# Altium project Ilk Proje.PrjPcb (part 1 of 3)
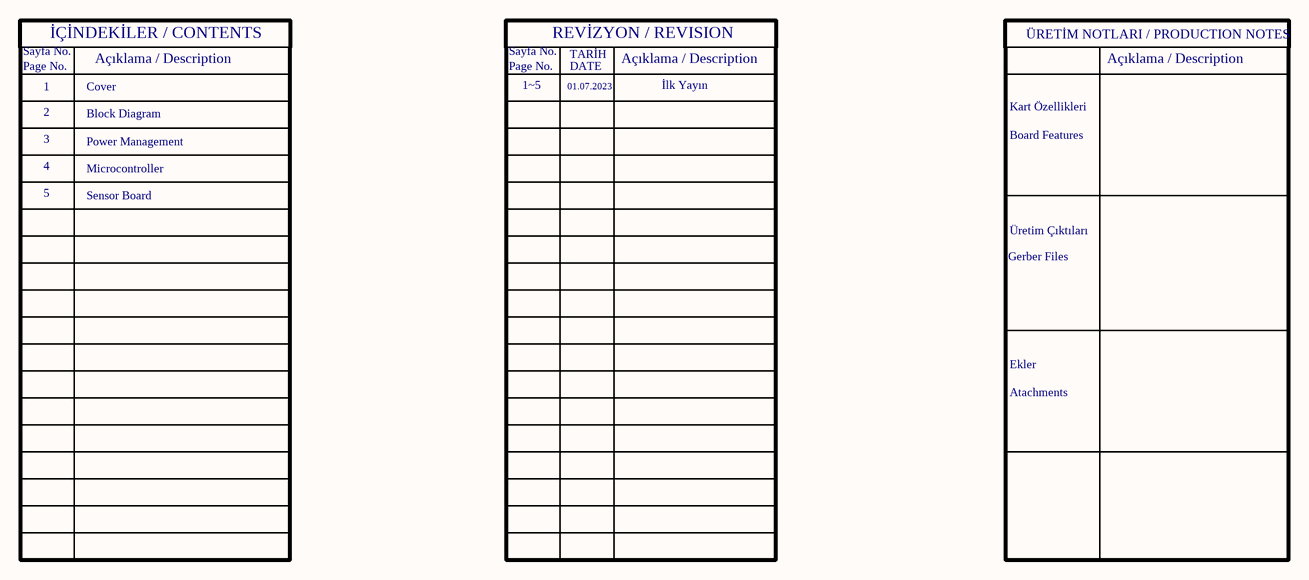
[diagram p0: Cover.SchDoc]
5 sheets, 127 parts. Net scope: global (net labels, ports and power ports of the same name join across sheets).
Board file: ilkproje.PcbDoc
Sheets:
  Cover.SchDoc
  Block Diyagrami.SchDoc
  Power Management.SchDoc
  MicroController.SchDoc
  Sensor Board.SchDoc

## Sheet Cover.SchDoc: Wireless Security Detector
size A4; SheetNumber: 1; SheetTotal: 5

### Notes on the sheet
- Sayfa No.
- Page No.
- İÇİNDEKİLER / CONTENTS
- Açıklama / Description
- REVİZYON / REVISION
- TARİH
- DATE
- ÜRETİM NOTLARI / PRODUCTION NOTES
- 1
- 2
- 3
- Cover
- Block Diagram
- 1~5
- 01.07.2023
- İlk Yayın
- Kart Özellikleri
- Board Features
- 4
- 5
- Power Management
- Microcontroller
- Sensor Board
- Gerber Files
- Üretim Çıktıları
- Ekler
- Atachments

## Sheet Block Diyagrami.SchDoc: Wireless Security Detector
size A3; ApprovedBy: Berke Tırpan; SheetNumber: 2; SheetTotal: 2; ENG_APP_DATE: --/--/--; DSN_APP_DATE: --/--/--; CHK_APP_DATE: --/--/--
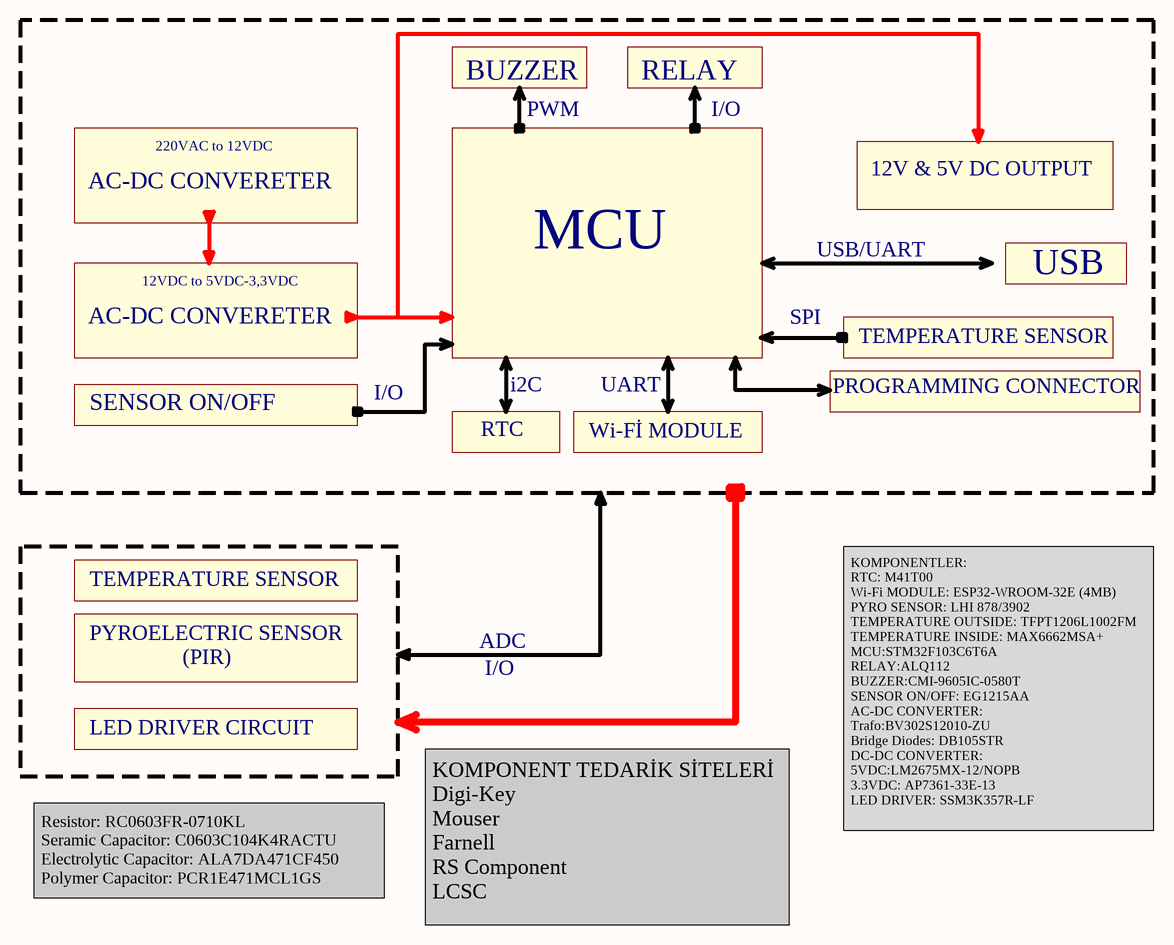
[diagram p1: Block Diyagrami.SchDoc]

### Notes on the sheet
- BUZZER
- RELAY
- 220VAC to 12VDC
- PWM
- I/O
- AC-DC CONVERETER
- 12V & 5V DC OUTPUT
- 12VDC to 5VDC-3,3VDC
- MCU
- USB/UART
- USB
- SPI
- TEMPERATURE SENSOR
- SENSOR ON/OFF
- RTC
- i2C
- Wi-Fİ MODULE
- UART
- PROGRAMMING CONNECTOR
- PYROELECTRIC SENSOR
- (PIR)
- ADC
- LED DRIVER CIRCUIT
- KOMPONENTLER:
  RTC: M41T00
  Wi-Fi MODULE: ESP32-WROOM-32E (4MB)
  PYRO SENSOR: LHI 878/3902
  TEMPERATURE OUTSIDE: TFPT1206L1002FM
  TEMPERATURE INSIDE: MAX6662MSA+
  MCU:STM32F103C6T6A
  RELAY:ALQ112
  BUZZER:CMI-9605IC-0580T
  SENSOR ON/OFF: EG1215AA
  AC-DC CONVERTER:
  Trafo:BV302S12010-ZU
  Bridge Diodes: DB105STR
  DC-DC CONVERTER:
  5VDC:LM2675MX-12/NOPB
  3.3VDC: AP7361-33E-13
  LED DRIVER: SSM3K357R-LF
- Resistor: RC0603FR-0710KL
  Seramic Capacitor: C0603C104K4RACTU
  Electrolytic Capacitor: ALA7DA471CF450
  Polymer Capacitor: PCR1E471MCL1GS
- KOMPONENT TEDARİK SİTELERİ
  Digi-Key
  Mouser
  Farnell
  RS Component
  LCSC

## Sheet Power Management.SchDoc: Wireless Security
size A3; Date: 29.06.2023; CompanyName: Freelance; Engineer: Berke Tırpan; SheetNumber: 3; SheetTotal: 5; PageSize: A3
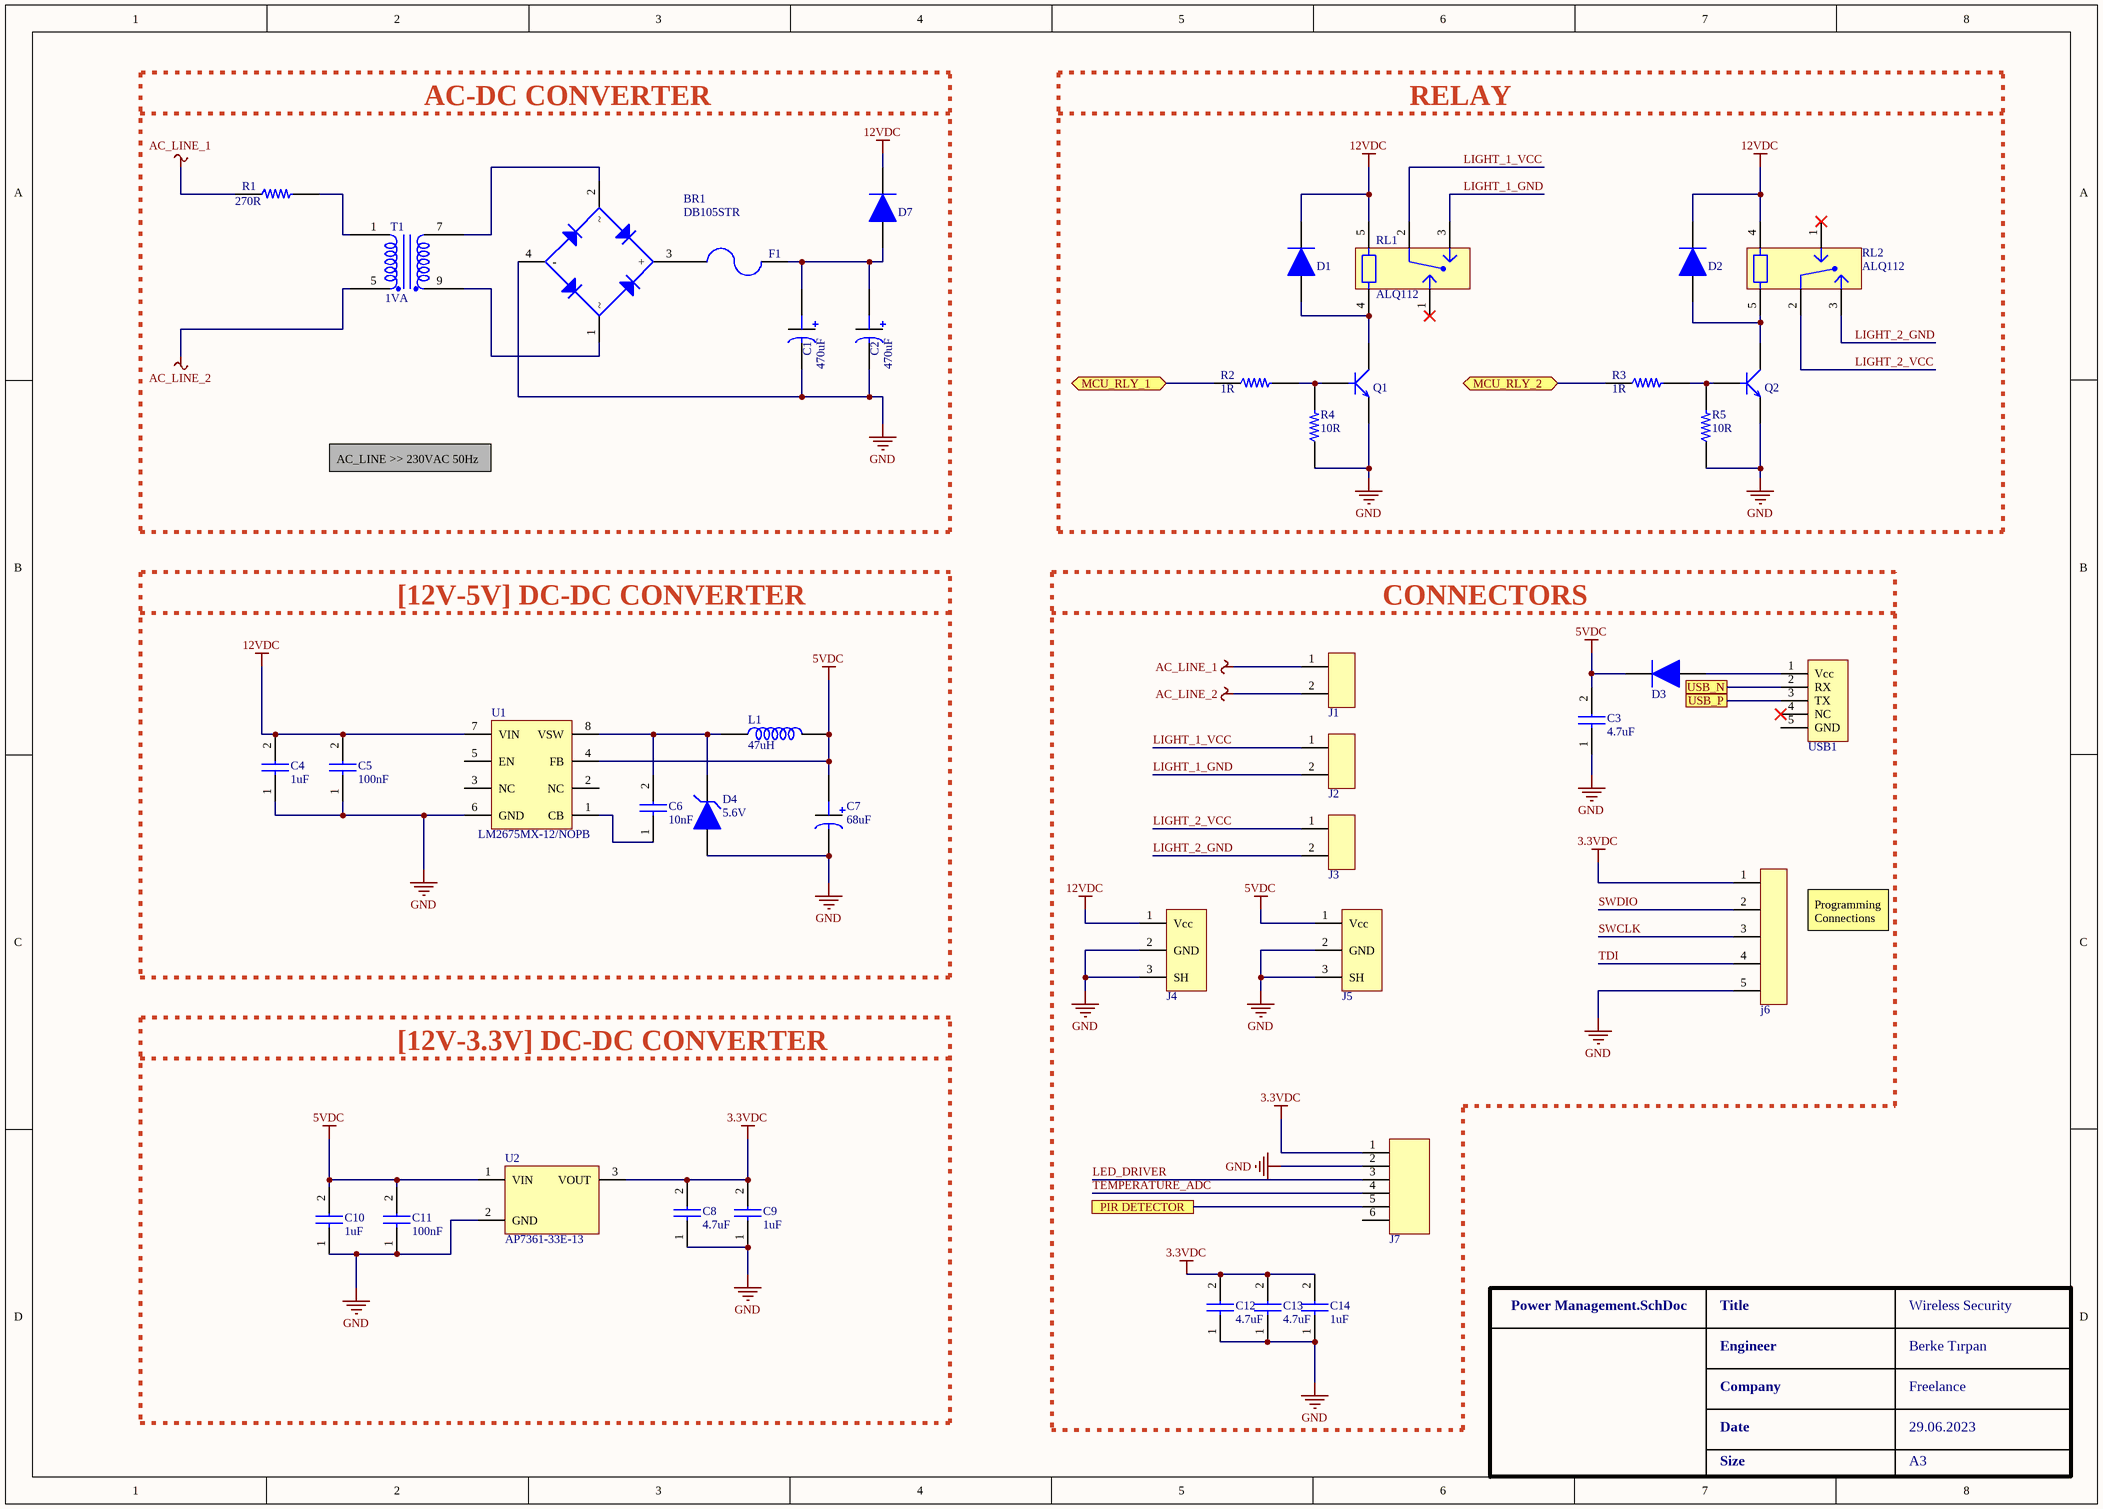
[diagram p2: Power Management.SchDoc]

### Parts
BR1  DB105STR  [DB105STR]
C1  Capacitance: 470uF  [CAP_RADIAL_D10_P5]  (hidden comment: ESH477M050AH4AA)
C2  Capacitance: 470uF  [CAP_RADIAL_D10_P5]  (hidden comment: ESH477M050AH4AA)
C3  Capacitance: 4.7uF  [CAP_0805]  (hidden comment: CAP_CER_4,7UF_0805)
C4  Capacitance: 1uF  [CAP_0805]  (hidden comment: CAP CER 1uF 0805)
C5  Capacitance: 100nF  [CAP_0805]  (hidden comment: CAP CER 100nF 0805)
C6  Capacitance: 10nF  [CAP_0603]  (hidden comment: CAP CER 10nF 0603)
C7  Capacitance: 68uF  [CAP_EEVSERIES]  (hidden comment: EEV686M035A9HAA)
C8  Capacitance: 4.7uF  [CAP_0805]  (hidden comment: CAP_CER_4,7UF_0805)
C9  Capacitance: 1uF  [CAP_0805]  (hidden comment: CAP CER 1uF 0805)
C10  Capacitance: 1uF  [CAP_0805]  (hidden comment: CAP CER 1uF 0805)
C11  Capacitance: 100nF  [CAP_0603]  (hidden comment: C0603C104K5RACTU)
C12  Capacitance: 4.7uF  [CAP_0805]  (hidden comment: CAP_CER_4,7UF_0805)
C13  Capacitance: 4.7uF  [CAP_0805]  (hidden comment: CAP_CER_4,7UF_0805)
C14  Capacitance: 1uF  [CAP_0805]  (hidden comment: CAP CER 1uF 0805)
D1  1N4148WS  [SOD323F]  (value not drawn)
D2  1N4148WS  [SOD323F]  (value not drawn)
D3  1N4148WS  [SOD323F]  (value not drawn)
D4  Zener Voltage: 5.6V  [SMB]  (hidden comment: 1SMB5919BT3G)
D7  1N4148WS  [SOD323F]  (value not drawn)
F1  FUSE 3413.0216.22  [3413.0216.22]  (value not drawn)
J1  TBP01R1-508-02BE  [TBP01R1-508]  (value not drawn)
J2  TBP01R1-508-02BE  [TBP01R1-508]  (value not drawn)
J3  TBP01R1-508-02BE  [TBP01R1-508]  (value not drawn)
J4  PJ-037AH-SMT-TR  [JACK]  (value not drawn)
J5  PJ-037AH-SMT-TR  [JACK]  (value not drawn)
j6  SMH-105-02-L-S  [PINHEADER1X5_RA]  (value not drawn)
J7  64800611622  [64800611622]  (value not drawn)
L1  Inductance: 47uH  [IND_1212]  (hidden comment: 78438335470)
Q1  MMBT3904-7-F  [SOT23-F]  (value not drawn)
Q2  MMBT3904-7-F  [SOT23-F]  (value not drawn)
R1  Resistance: 270R  [RES_AXIAL_W]  (hidden comment: 5WD27)
R2  Resistance: 1R  [RES_0603]  (hidden comment: RT0603BRD071KL)
R3  Resistance: 1R  [RES_0603]  (hidden comment: RT0603BRD071KL)
R4  Resistance: 10R  [RES_0603]  (hidden comment: RC0603FR-0710KL)
R5  Resistance: 10R  [RES_0603]  (hidden comment: RC0603FR-0710KL)
RL1  ALQ112  [ALQ112]
RL2  ALQ112  [ALQ112]
T1  Rated Power: 1VA  [BV302S12010-ZU]  (hidden comment: BV302S12010-ZU)
U1  LM2675MX-12/NOPB  [SOIC8]
U2  AP7361-33E-13  [SOT223]
USB1  10118192-0001LF  [MICRO_B_USB]  (value not drawn)

### Blocks framed on the sheet
AC-DC CONVERTER: BR1 C1 C2 D7 F1 R1 T1
RELAY: D1 D2 Q1 Q2 R2-R5 RL1 RL2
[12V-5V] DC-DC CONVERTER: C4-C7 D4 L1 U1
CONNECTORS: C3 C12-C14 D3 J1-J5 j6 J7 USB1
[12V-3.3V] DC-DC CONVERTER: C8-C11 U2

### Ports
MCU_RLY_1 (bidir, see MicroController[4B]), MCU_RLY_2 (bidir, see MicroController[4B]), PIR DETECTOR (see MicroController[4B]), USB_N (see MicroController[4A]), USB_P (see MicroController[4A])

### Nets
3.3VDC: C8.2 C9.2 C12.2 C13.2 C14.2 j6.1 J7.1 U2.3(VOUT)
5VDC: C3.2 C7.1 C10.2 C11.2 D3.1 J5.1(Vcc) L1.2 U1.4(FB) U2.1(VIN)
12VDC: C4.2 C5.2 D1.1 D2.1 D7.1 J4.1(Vcc) RL1.5 RL2.4 U1.7(VIN)
AC_LINE_1: J1.1 R1.1
AC_LINE_2: J1.2 T1.5
GND: BR1.4(-) C1.2 C2.2 C3.1 C4.1 C5.1 C7.2 C8.1 C9.1 C10.1 C11.1 C12.1 C13.1 C14.1 D4.A J4.2(GND) J4.3(SH) J5.2(GND) J5.3(SH) j6.5 J7.2 Q1.2(E) Q2.2(E) R4.1 R5.1 U1.6(GND) U2.2(GND)
LED_DRIVER: J7.3
LIGHT_1_GND: J2.2 RL1.3
LIGHT_1_VCC: J2.1 RL1.2
LIGHT_2_GND: J3.2 RL2.3
LIGHT_2_VCC: J3.1 RL2.2
SWCLK: j6.3
SWDIO: j6.2
TDI: j6.4
TEMPERATURE_ADC: J7.4
USB_N: USB1.2(RX) ; port USB_N
USB_P: USB1.3(TX) ; port USB_P
NetBR1_1: BR1.1 T1.9
NetBR1_2: BR1.2 T1.7
NetBR1_3: BR1.3(+) F1.1
NetC1_1: C1.1 C2.1 D7.2 F1.2
NetC6_1: C6.1 U1.1(CB)
NetC6_2: C6.2 D4.C L1.1 U1.8(VSW)
NetD1_2: D1.2 Q1.3(C) RL1.4
NetD2_2: D2.2 Q2.3(C) RL2.5
NetD3_2: D3.2 USB1.1(Vcc)
NetJ7_5: J7.5 ; port PIR DETECTOR
NetQ1_1: Q1.1(B) R2.2 R4.2
NetQ2_1: Q2.1(B) R3.2 R5.2
NetR1_2: R1.2 T1.1
NetR2_1: R2.1 ; port MCU_RLY_1
NetR3_1: R3.1 ; port MCU_RLY_2

Not connected (* = marked no-connect by the designer): J7 6; RL1 1*; RL2 1*; U1 2(NC) 3(NC) 5(EN); USB1 4(NC)* 5(GND)

### Notes on the sheet
- AC_LINE >> 230VAC 50Hz
- (near j6) Programming Connections
- Title
- Engineer
- Company
- Date
- Size

### Library data of the parts
BR1 = DB105STR: Bridge Rect 1PHASE 600V 1A Db-s; Manufacturer: Sangdest Microelectronics; Manufacturer Part Number: DB105S; Desinged by: BERKE; Supplier 1: Digi-Key; RoHS: No; Category: Uncategorized; Stock 1: 22736; Pricing 1: 1=0,42, 10=0,314, 100=0,1957, 500=0,1339 (USD); Supplier Part Number 1: 1655-DB105SCT-ND; Operating Voltage: 600V; Max Current: 1A
C1 C2 = CAP ALU ELEC 470.UF 50V: Cap, 470UF, 50V, Alu Elec, Radial; Manufacturer: KEMET; Desinged by: BERKE; Tolerance: 20%; Supplier 1: Digi-Key; Manufacturer Part Number: ESH477M050AH4AA; RoHS: Yes; Stock 1: 6765; Pricing 1: 1=0,7, 10=0,496, 50=0,3748, 100=0,3264, 500=0,24178, 1000=0,20551, 2500=0,19342, 5000=0,18134 (USD); Mount: Through Hole; Case/Package: Radial; Min Operating Temperature: -40°C; Max Operating Temperature: 105°C; Packaging: Bulk; Voltage Rating: 50V; Series: ESH; RoHS Compliant: Yes; ComponentLink1URL: https://api.kemet.com/component-edge/download/datasheet/ESH477M050AH4AA.pdf?src-supplier=Digi-Key; ComponentLink1Description: https://api.kemet.com/component-edge/download/datasheet/ESH477M050AH4AA.pdf?src-supplier=Digi-Key; Supplier Part Number 1: 399-15683-ND
C3 C8 C12 C13 = CAP_CER_4,7UF_0805: CAP CER 4.7UF 25V %10 0805; Manufacturer: Samsung; Manufacturer Part Number: CL21A475KAQNNNE; Tolerance: 10%; Dielectric: X5R; Desinged by: BERKE; Supplier 1: Digi-Key; RoHS: Yes; Category: Ceramic Capacitors; Stock 1: 4065249; Pricing 1: 1=0,1, 10=0,073, 50=0,0414, 100=0,0344, 500=0,02408, 1000=0,01994 (USD); Mount: Surface Mount; Case/Package: 0805; Case Code (Metric): 2012; Case Code (Imperial): 0805; Min Operating Temperature: -55°C; Max Operating Temperature: 85°C; Packaging: Tape and Reel; Voltage Rating: 25V; Voltage Rating (DC): 25V; Series: CL; Construction: Flat; Length: 2mm; Height: 1.25mm; Depth: 1.25mm; Radiation Hardening: No; Lead Free: Lead Free; RoHS Compliant: Yes; ComponentLink1URL: https://datasheet.ciiva.com/25798/cl21a475kaqnnne-25798882.pdf?src-supplier=Digi-Key; ComponentLink1Description: https://datasheet.ciiva.com/25798/cl21a475kaqnnne-25798882.pdf?src-supplier=Digi-Key; Supplier Part Number 1: 1276-1244-1-ND
C4 C9 C10 C14 = CAP CER 1uF 0805: CAP CER 1UF 50V X7R %10 0805; Manufacturer: Samsung; Manufacturer Part Number: CL21B105KBFNNNE; Desinged by: BERKE; Tolerance: 10%; Supplier 1: Digi-Key; RoHS: Yes; Category: Ceramic Capacitors; Stock 1: 84626; Pricing 1: 1=0,11, 10=0,079, 50=0,045, 100=0,0373, 500=0,02616, 1000=0,02165 (USD); Mount: Surface Mount; Case/Package: 0805; Case Code (Metric): 2012; Case Code (Imperial): 0805; Min Operating Temperature: -55°C; Max Operating Temperature: 125°C; Packaging: Tape and Reel; Package Quantity: 1; Voltage Rating: 50V; Dielectric: X7R; Voltage: 50V; Series: CL; Construction: Flat; Length: 2mm; Width: 0.049inch; Height: 1.25mm; Thickness: 0.053inch; Depth: 1.25mm; Radiation Hardening: No; RoHS Compliant: Yes; ComponentLink1URL: https://datasheet.ciiva.com/25800/cl21b105kbfnnne-25800291.pdf?src-supplier=Digi-Key; ComponentLink1Description: https://datasheet.ciiva.com/25800/cl21b105kbfnnne-25800291.pdf?src-supplier=Digi-Key; Supplier Part Number 1: 1276-1029-1-ND
C5 = CAP CER 100nF 0805: CAP CER 0.1UF 50V X7R 0805; Manufacturer: Samsung; Manufacturer Part Number: CL21B104KBCNNNC; Desinged by: BERKE; Material: Ceramic; Tolerance: 10%; Supplier 1: Digi-Key; RoHS: Yes; Category: Ceramic Capacitors; Stock 1: 1331466; Pricing 1: 1=0,1, 10=0,044, 50=0,024, 100=0,0196, 500=0,01404, 1000=0,01103 (USD); Mount: Surface Mount; Case/Package: 0805; Case Code (Metric): 2012; Case Code (Imperial): 0805; Min Operating Temperature: -55°C; Max Operating Temperature: 125°C; Dielectric: X7R; Packaging: Tape and Reel; Voltage Rating: 50V; Voltage: 50V; Voltage Rating (DC): 50V; Series: CL; Construction: Flat; Length: 2mm; Width: 0.049inch; Height: 0.85mm; Depth: 1.25mm; Thickness: 0.037inch; Radiation Hardening: No; Lead Free: Lead Free; RoHS Compliant: Yes; ComponentLink1URL: https://datasheet.ciiva.com/25710/cl21b104kbcnnnc-25710182.pdf?src-supplier=Digi-Key; ComponentLink1Description: https://datasheet.ciiva.com/25710/cl21b104kbcnnnc-25710182.pdf?src-supplier=Digi-Key; ComponentLink2URL: https://datasheet.ciiva.com/29199/454152-da-01-en-vs-kondensator-0805-29199814.pdf?src-supplier=Conrad; ComponentLink2Description: https://datasheet.ciiva.com/29199/454152-da-01-en-vs-kondensator-0805-29199814.pdf?src-supplier=Conrad; Supplier Part Number 1: 1276-1003-1-ND
C6 = CAP CER 10nF 0603: Multilayer Ceramic Capacitor, 0.01 F, 10%, X7R, 16 V, 0603 [1608 Metric] RoHS Compliant: Yes; Manufacturer: Walsin Technologies; Manufacturer Part Number: 0603B103K160CT; Desinged by: BERKE; Voltage Rating: 16V; Supplier 1: Digi-Key; RoHS: Yes; Category: Ceramic Capacitors; Stock 1: 54105; Pricing 1: 1=0,1, 10=0,033, 50=0,0182, 100=0,0148, 500=0,0106, 1000=0,00833 (USD); Case Code (Metric): 1608; Case Code (Imperial): 0603; Min Operating Temperature: -55°C; Max Operating Temperature: 125°C; Tolerance: 10%; Packaging: Tape and Reel; Dielectric: X7R; Voltage Rating (DC): 16V; RoHS Compliant: Yes; Reach SVHC Compliant: Unknown; ComponentLink1URL: http://www.farnell.com/datasheets/1958513.pdf?src-supplier=Farnell; ComponentLink1Description: http://www.farnell.com/datasheets/1958513.pdf?src-supplier=Farnell; ComponentLink2URL: http://www.farnell.com/datasheets/1958513.pdf?src-supplier=Element14; ComponentLink2Description: http://www.farnell.com/datasheets/1958513.pdf?src-supplier=Element14; ComponentLink3URL: http://www.passivecomponent.com/wp-content/uploads/2018/10/MLCC.pdf?src-supplier=Digi-Key; ComponentLink3Description: http://www.passivecomponent.com/wp-content/uploads/2018/10/MLCC.pdf?src-supplier=Digi-Key; Supplier Part Number 1: 1292-1384-1-ND
C7 = CAP ALU 68uF: Cap Aluminum Lytic 68uF 35V 20% (6.3 X 7.7mm) SMD 280mA 2000h 105C T/R; Manufacturer: KEMET; Desinged by: BERKE; Impedance: 340mR; Ripple Current: 196mA; Supplier 1: Digi-Key; Manufacturer Part Number: EEV686M035A9HAA; RoHS: Yes; Category: Aluminum Electrolytic Capacitors; Stock 1: 22971; Pricing 1: 1=0,64, 10=0,451, 50=0,3414, 100=0,2973, 500=0,22022 (USD); Mount: Surface Mount; Case/Package: Radial; Min Operating Temperature: -40°C; Max Operating Temperature: 105°C; Packaging: Tape and Reel; Package Quantity: 1; Voltage Rating: 35V; Tolerance: 20%; Voltage Rating (DC): 35V; Termination: SMD/SMT; Series: EEV; Length: 7.7mm; Height - Seated (Max): 0.315inch; RoHS Compliant: Yes; ComponentLink1URL: https://datasheet.ciiva.com/5365/kem-a4002-eev-535332-5365784.pdf?src-supplier=Mouser; ComponentLink1Description: https://datasheet.ciiva.com/5365/kem-a4002-eev-535332-5365784.pdf?src-supplier=Mouser; Supplier Part Number 1: 399-6722-1-ND
C11 = CAP CER 100nF 0603: Multilayer Ceramic Capacitors (MLCC) - SMD/SMT 50volts 0.1uF X7R 10%; Manufacturer: KEMET; Voltage: 50V; Desinged by: BERKE; Supplier 1: Digi-Key; Manufacturer Part Number: C0603C104K5RACTU; RoHS: Yes; Category: Ceramic Capacitors; Stock 1: 10147790; Pricing 1: 1=0,11, 10=0,078, 50=0,0424, 100=0,0346, 500=0,02474, 1000=0,01944 (USD); Mount: Surface Mount; Case/Package: 0603; Min Operating Temperature: -55°C; Max Operating Temperature: 125°C; Tolerance: 10%; Packaging: Tape and Reel; Dielectric: X7R; Series: SMD Comm X7R; Voltage Rating: 50V; Length: 0.063inch; Width: 0.031inch; Thickness: 0.034inch; RoHS Compliant: Yes; Supplier Part Number 1: 399-C0603C104K5RAC7867CT-ND
D1-D3 D7 = 1N4148WS: VR=75V IF=150mA Trr=4ns P=200mW; Manufacturer: ON Semiconductor / Fairchild; Desinged by: BERKE; Forward Current: 150mA; Max Repetitive Reverse Voltage (Vrrm): 75V; Reverse Recovery Time: 4ns; Max Reverse Current: 5uA; Max Forward Surge Current (Ifsm): 2A; Element Configuration: Single; Supplier 1: Digi-Key; Manufacturer Part Number: 1N4148WS; RoHS: Yes; Category: Rectifier Diodes; Stock 1: 1609214; Pricing 1: 1=0,19, 10=0,174, 100=0,0949, 500=0,05838, 1000=0,0398 (USD); Mount: Surface Mount; Number of Pins: 2; Weight: 0.0276g; Min Operating Temperature: -55°C; Max Operating Temperature: 150°C; Packaging: Tape and Reel; Average Rectified Current: 150mA; Max Reverse Voltage (DC): 75V; Series: -; Package Quantity: 1; Recovery Time: 4ns; Reverse Voltage: 75V; Length: 1.8mm; Width: 1.35mm; Height: 1mm; Radiation Hardening: No; RoHS Compliant: Yes; Reach SVHC Compliant: No; Lead Free: Lead Free; ComponentLink1URL: https://datasheet.ciiva.com/30479/0900766b810e1cd3-30479206.pdf?src-supplier=Rs; ComponentLink1Description: https://datasheet.ciiva.com/30479/0900766b810e1cd3-30479206.pdf?src-supplier=Rs; ComponentLink2URL: https://datasheet.ciiva.com/15208/getdatasheetpartid-127819-15208358.pdf?src-supplier=Verical; ComponentLink2Description: https://datasheet.ciiva.com/15208/getdatasheetpartid-127819-15208358.pdf?src-supplier=Verical; ComponentLink3URL: https://datasheet.ciiva.com/8300/1n914bws-8300360.pdf?src-supplier=Avnet; ComponentLink3Description: https://datasheet.ciiva.com/8300/1n914bws-8300360.pdf?src-supplier=Avnet; ComponentLink4URL: https://datasheet.ciiva.com/910/1n4148ws-910381.pdf?src-supplier=Digi-Key; ComponentLink4Description: https://datasheet.ciiva.com/910/1n4148ws-910381.pdf?src-supplier=Digi-Key; ComponentLink5URL: https://datasheet.ciiva.com/910/1n4148ws-910382.pdf?src-supplier=Digi-Key; ComponentLink5Description: https://datasheet.ciiva.com/910/1n4148ws-910382.pdf?src-supplier=Digi-Key; ComponentLink6URL: https://datasheet.ciiva.com/910/1n4148ws-910380.pdf?src-supplier=Digi-Key; ComponentLink6Description: https://datasheet.ciiva.com/910/1n4148ws-910380.pdf?src-supplier=Digi-Key; Supplier Part Number 1: 1N4148WSFSCT-ND
D4 = 1SMB5919BT3G: Vz=5.6V 5.32V~5.88V Izt=66.9mA; Manufacturer: ON Semiconductor; Desinged by: BERKE; Material: Plastic; Max Power Dissipation: 3W; Tolerance: 5%; Max Reverse Leakage Current: 5uA; Impedance: 2R; Forward Voltage: 1.5V; Power Dissipation: 550mW; Zener Current: 267mA; Test Current: 66.9mA; Breakdown Voltage: 5.88V; Supplier 1: Digi-Key; Manufacturer Part Number: 1SMB5919BT3G; RoHS: Yes; Category: Zener Diodes; Pricing 1: 1=0,49, 10=0,37, 100=0,2304, 500=0,15764, 1000=0,12126 (USD); Case/Package: SMB; Number of Pins: 2; Min Operating Temperature: -65°C; Max Operating Temperature: 150°C; Package Quantity: 2500; Packaging: Tape and Reel; Series: -; Voltage Tolerance: 5%; Working Voltage: 5.6V; Max Reverse Current: 5uA; Voltage Rating (DC): 5.6V; Power Rating: 3W; Length: 4.32mm; Width: 3.56mm; Height: 2.13mm; Radiation Hardening: No; Lead Free: Lead Free; Halogen Free: Halogen Free; RoHS Compliant: Yes; Reach SVHC Compliant: No; ComponentLink1URL: https://datasheet.ciiva.com/27747/1308331-27747654.pdf?src-supplier=Jameco; ComponentLink1Description: https://datasheet.ciiva.com/27747/1308331-27747654.pdf?src-supplier=Jameco; ComponentLink2URL: https://datasheet.ciiva.com/1182/1smb5913bt3-d-1182657.pdf?src-supplier=Element14; ComponentLink2Description: https://datasheet.ciiva.com/1182/1smb5913bt3-d-1182657.pdf?src-supplier=Element14; ComponentLink3URL: https://datasheet.ciiva.com/1182/1smb5913bt3-d-1182658.pdf?src-supplier=Element14; ComponentLink3Description: https://datasheet.ciiva.com/1182/1smb5913bt3-d-1182658.pdf?src-supplier=Element14; ComponentLink4URL: https://datasheet.ciiva.com/16311/1smb5913bt3-d-16311847.pdf?src-supplier=Future+Electronics; ComponentLink4Description: https://datasheet.ciiva.com/16311/1smb5913bt3-d-16311847.pdf?src-supplier=Future+Electronics; ComponentLink5URL: https://datasheet.ciiva.com/15198/getdatasheetpartid-311040-15198695.pdf?src-supplier=Verical; ComponentLink5Description: https://datasheet.ciiva.com/15198/getdatasheetpartid-311040-15198695.pdf?src-supplier=Verical; ComponentLink6URL: https://datasheet.ciiva.com/895/1smb5913bt3-d-895204.pdf?src-supplier=Digi-Key; ComponentLink6Description: https://datasheet.ciiva.com/895/1smb5913bt3-d-895204.pdf?src-supplier=Digi-Key; ComponentLink7URL: https://datasheet.ciiva.com/895/1smb5913bt3-d-895205.pdf?src-supplier=Digi-Key; ComponentLink7Description: https://datasheet.ciiva.com/895/1smb5913bt3-d-895205.pdf?src-supplier=Digi-Key; ComponentLink8URL: https://datasheet.ciiva.com/895/1smb5913bt3-d-895203.pdf?src-supplier=Digi-Key; ComponentLink8Description: https://datasheet.ciiva.com/895/1smb5913bt3-d-895203.pdf?src-supplier=Digi-Key; Supplier Part Number 1: 1SMB5919BT3GOSDKR-ND
F1 = FUSE 3413.0216.22: Fuse Chip Fast Acting 1A 32V SMD Solder Pad 1206 Glass T/R VDE/cULus; Manufacturer: Schurter; Body Material: Glass,Epoxy; Voltage Rating (DC): 63V; DC Cold Resistance: 94.2mR; Fuse Type: Board Mount (Cartridge Style Excluded); Approvals: VDE,cURus; Desinged by: BERKE; Supplier 1: Digi-Key; Manufacturer Part Number: 3413.0216.22; RoHS: Yes; Category: Fuses; Stock 1: 9238; Pricing 1: 1=0,67, 50=0,524, 100=0,397, 500=0,3132 (USD); Mount: Surface Mount,PCB; Case/Package: 1206; Number of Pins: 2; Weight: 0.000212oz; Case Code (Metric): 3216; Case Code (Imperial): 1206; Contact Plating: Gold; Terminal Material: Tin; Min Operating Temperature: -55°C; Max Operating Temperature: 90°C; Current Rating: 1A; Package Quantity: 1000; Voltage Rating (AC): 32V; Packaging: Tape and Reel; Voltage Rating: 32V; Termination: SMD/SMT; Working Voltage: 32V; Series: USI 1206; Length: 3.2mm; Width: 1.6mm; Height: 0.6mm; Lead Free: Lead Free; RoHS Compliant: Yes; ComponentLink1URL: https://datasheet.ciiva.com/301/typ-usi-1206-301440.pdf?src-supplier=Digi-Key; ComponentLink1Description: https://datasheet.ciiva.com/301/typ-usi-1206-301440.pdf?src-supplier=Digi-Key; ComponentLink2URL: https://datasheet.ciiva.com/14541/70160006-14541114.pdf?src-supplier=Allied+Electronics; ComponentLink2Description: https://datasheet.ciiva.com/14541/70160006-14541114.pdf?src-supplier=Allied+Electronics; ComponentLink3URL: https://datasheet.ciiva.com/301/typ-usi-1206-301439.pdf?src-supplier=Digi-Key; ComponentLink3Description: https://datasheet.ciiva.com/301/typ-usi-1206-301439.pdf?src-supplier=Digi-Key; ComponentLink4URL: https://datasheet.ciiva.com/301/typ-usi-1206-301441.pdf?src-supplier=Digi-Key; ComponentLink4Description: https://datasheet.ciiva.com/301/typ-usi-1206-301441.pdf?src-supplier=Digi-Key; ComponentLink5URL: https://datasheet.ciiva.com/8264/typ-usi-1206-8264583.pdf?src-supplier=Avnet; ComponentLink5Description: https://datasheet.ciiva.com/8264/typ-usi-1206-8264583.pdf?src-supplier=Avnet; ComponentLink6URL: https://datasheet.ciiva.com/14102/qousi1206-data-e-14102903.pdf?src-supplier=Distrelec; ComponentLink6Description: https://datasheet.ciiva.com/14102/qousi1206-data-e-14102903.pdf?src-supplier=Distrelec; ComponentLink7URL: https://datasheet.ciiva.com/16316/typ-usi-1206-16316588.pdf?src-supplier=Future+Electronics; ComponentLink7Description: https://datasheet.ciiva.com/16316/typ-usi-1206-16316588.pdf?src-supplier=Future+Electronics; Supplier Part Number 1: 486-1144-1-ND
J1-J3 = TBP01R1-508-02BE: 2~24 Poles, Pluggable, Receptacle, Horizontal, 5.08 Pitch, Terminal Block Connector; Manufacturer: CUI; Desinged by: BERKE; Supplier 1: Future Electronics; Manufacturer Part Number: TBP01R1-508-02BE; RoHS: Yes; Supplier Part Number 1: 1117528
J4 J5 = PJ-037AH-SMT-TR: 2.0 x 6.3 mm, 5.0 A, Horizontal, Surface Mount (SMT), Dc Power Jack Connector; Manufacturer: CUI; Desinged by: BERKE; Number of Conductors: 2; Gender: Male; Shielding: Unshielded; Current Rating: 5A; Voltage Rating: 24V; Insulation Resistance: 100MR; Supplier 1: Digi-Key; Manufacturer Part Number: PJ-037AH-SMT-TR; RoHS: Yes; Category: Uncategorized; Mount: Surface Mount,Through Hole; Case/Package: SMD/SMT; Color: Black; Contact Material: Copper; Contact Plating: Nickel; Housing Color: Black; Housing Material: Thermoplastic; Min Operating Temperature: -25°C; Max Operating Temperature: 85°C; Orientation: Horizontal; Package Quantity: 200; Termination: Solder; Connector Type: Jack; Contact Gender: Male; Packaging: Tape and Reel; Flammability Rating: UL94 V-0; ComponentLink1URL: http://www.mouser.com/ds/2/670/pj-037ah-smt-516065.pdf?src-supplier=Mouser; ComponentLink1Description: http://www.mouser.com/ds/2/670/pj-037ah-smt-516065.pdf?src-supplier=Mouser; ComponentLink2URL: https://www.cui.com/product/resource/digikeypdf/pj-037ah-smt-tr.pdf?src-supplier=Digi-Key; ComponentLink2Description: https://www.cui.com/product/resource/digikeypdf/pj-037ah-smt-tr.pdf?src-supplier=Digi-Key; ComponentLink3URL: http://www.cui.com/product/resource/digikeypdf/pj-037ah-smt.pdf?src-supplier=Digi-Key; ComponentLink3Description: http://www.cui.com/product/resource/digikeypdf/pj-037ah-smt.pdf?src-supplier=Digi-Key; Supplier Part Number 1: CP-037AHPJCT-ND
j6 = SMH-105-02-L-S: .100 C.L. HORIZONTAL SMT SOCKET; Manufacturer: Samtec; Desinged by: BERKE; Number of Contacts: 5; Gender: Receptacle; Pitch: 2.54mm; Supplier 1: Digi-Key; Manufacturer Part Number: SMH-105-02-L-S; RoHS: Yes; Category: Connectors; Stock 1: 101; Pricing 1: 1=2,18, 10=1,899, 100=1,6968, 500=1,414, 1000=1,212, 5000=1,07464 (USD); Contact Plating: Gold; Contact Material: Bronze; Contact Finish - Mating: GOLD; Insulation Color: Black; Insulation Material: Polymer; Contact Shape: Square; Min Operating Temperature: -55°C; Max Operating Temperature: 125°C; Packaging: Rail/Tube; Number of Rows: 1; Termination: Solder; Connector Type: Receptacle; Fastening Type: Pull; Series: SMH; Contact Type: Forked; Number of Positions: 5; Orientation: Horizontal; Radiation Hardening: No; RoHS Compliant: Yes; Reach SVHC Compliant: No; Flammability Rating: UL94 V-0; ComponentLink1URL: http://www.farnell.com/datasheets/1927708.pdf?_ga=2.237598468.569325269.1503285096-1413671594.1503025027&src-supplier=Farnell; ComponentLink1Description: http://www.farnell.com/datasheets/1927708.pdf?_ga=2.237598468.569325269.1503285096-1413671594.1503025027&src-supplier=Farnell; ComponentLink2URL: http://www.samtec.com/documents/webfiles/pdf/SMH.PDF?src-supplier=Newark; ComponentLink2Description: http://www.samtec.com/documents/webfiles/pdf/SMH.PDF?src-supplier=Newark; ComponentLink3URL: http://www.samtec.com/documents/webfiles/pdf/SMH.PDF?src-supplier=Avnet; ComponentLink3Description: http://www.samtec.com/documents/webfiles/pdf/SMH.PDF?src-supplier=Avnet; ComponentLink4URL: http://suddendocs.samtec.com/catalog_english/smh.pdf?src-supplier=Digi-Key; ComponentLink4Description: http://suddendocs.samtec.com/catalog_english/smh.pdf?src-supplier=Digi-Key; Supplier Part Number 1: SAM11813-ND
J7 = 64800611622_conn_6pin: WR-WTB Wire-to-Board Connectors 6PIN 1.50 mm; Manufacturer: Wurth Electronics; Desinged by: BERKE; Supplier 1: Digi-Key; Manufacturer Part Number: 64800611622; RoHS: No; Category: Uncategorized; Stock 1: 929; Pricing 1: 1=0,42, 50=0,406, 100=0,384, 250=0,361, 500=0,339 (USD); Supplier Part Number 1: 732-64800611622-ND
L1 = IND 47uH: Power Inductor, Aec-Q200, 47Uh, 0.39A Rohs Compliant: Yes |Wurth Elektronik 78438335470; Manufacturer: Wurth Electronics; Desinged by: BERKE; Core Material: Ferrite; Current Rating: 390mA; Saturation Current: 1.18A; Shielding: Shielded; DC Resistance (DCR): 2.3R; Self Resonant Frequency: 8MHz; Test Frequency: 100kHz; Tolerance: 30%; Supplier 1: Digi-Key; Manufacturer Part Number: 78438335470; RoHS: Yes; Category: Fixed Inductors; Stock 1: 14920; Pricing 1: 1=2,11, 50=1,97, 250=1,803, 500=1,672 (USD); Mount: Surface Mount; Case/Package: 1212; Case Code (Metric): 3030; Case Code (Imperial): 1212; Min Operating Temperature: -40°C; Max Operating Temperature: 125°C; Packaging: Cut Tape; Series: WE-MAIA; Length: 0.118inch; Width: 0.118inch; Height - Seated (Max): 0.059inch; Ratings: AEC-Q200; RoHS Compliant: Yes; ComponentLink1URL: https://media.digikey.com/pdf/Data%20Sheets/Wurth%20Electronics%20PDFs/Q+_Products_Flyer.pdf?src-supplier=Digi-Key; ComponentLink1Description: https://media.digikey.com/pdf/Data%20Sheets/Wurth%20Electronics%20PDFs/Q+_Products_Flyer.pdf?src-supplier=Digi-Key; Supplier Part Number 1: 732-6947-1-ND
Q1 Q2 = MMBT3904-7-F: NPN Ic=200mA Vceo=40V hfe=100~300 fT=310MHz P=300mW SOT-23; Manufacturer: Diodes Zetex; Desinged by: BERKE; Max Power Dissipation: 300mW; Collector Emitter Voltage (VCEO): 40V; Max Collector Current: 200mA; Collector Base Voltage (VCBO): 60V; Power Dissipation: 350mW; Frequency: 300MHz; hFE Min: 100; Number of Elements: 1; Emitter Base Voltage (VEBO): 6V; Collector Emitter Saturation Voltage: 300mV; Supplier 1: Digi-Key; Manufacturer Part Number: MMBT3904-7-F; RoHS: Yes; Category: BJTs; Stock 1: 6383011; Pricing 1: 1=0,12, 10=0,11, 100=0,0601, 500=0,03696, 1000=0,0252 (USD); Mount: Surface Mount; Case/Package: SOT-23; Number of Pins: 3; Weight: 0.000282oz; Min Operating Temperature: -55°C; Max Operating Temperature: 150°C; Polarity: NPN; Packaging: Tape and Reel; Package Quantity: 3000; Transition Frequency: 300MHz; Collector Emitter Breakdown Voltage: 40V; Max Breakdown Voltage: 40V; Continuous Collector Current: 200mA; Max Frequency: 300MHz; Gain Bandwidth Product: 300MHz; Voltage Rating (DC): 40V; Series: Automotive, AEC-Q101; Collector-emitter Voltage-Max: 300mV; Length: 3.05mm; Width: 1.4mm; Height: 1mm; Radiation Hardening: No; Reach SVHC Compliant: No; Lead Free: Lead Free; RoHS Compliant: Yes; ComponentLink1URL: https://datasheet.ciiva.com/11201/ds30036-11201778.pdf?src-supplier=Avnet; ComponentLink1Description: https://datasheet.ciiva.com/11201/ds30036-11201778.pdf?src-supplier=Avnet; ComponentLink2URL: https://datasheet.ciiva.com/15138/getdatasheetpartid-53265-15138780.pdf?src-supplier=Verical; ComponentLink2Description: https://datasheet.ciiva.com/15138/getdatasheetpartid-53265-15138780.pdf?src-supplier=Verical; ComponentLink3URL: https://datasheet.ciiva.com/22711/1915516-22711750.pdf?src-supplier=Element14; ComponentLink3Description: https://datasheet.ciiva.com/22711/1915516-22711750.pdf?src-supplier=Element14; ComponentLink4URL: https://datasheet.ciiva.com/11198/ds30036-11198999.pdf?src-supplier=Avnet; ComponentLink4Description: https://datasheet.ciiva.com/11198/ds30036-11198999.pdf?src-supplier=Avnet; ComponentLink5URL: https://datasheet.ciiva.com/6361/ds30036-6361256.pdf?src-supplier=Digi-Key; ComponentLink5Description: https://datasheet.ciiva.com/6361/ds30036-6361256.pdf?src-supplier=Digi-Key; ComponentLink6URL: https://datasheet.ciiva.com/6361/ds30036-6361254.pdf?src-supplier=Digi-Key; ComponentLink6Description: https://datasheet.ciiva.com/6361/ds30036-6361254.pdf?src-supplier=Digi-Key; Supplier Part Number 1: MMBT3904-FDICT-ND
R1 = 5WD27: RES 0.27 OHM 5% 5W AXIAL; Mfr: NTE Electronics, Inc; Desinged by: BERKE; Temperature Coefficient: ±300ppm/°C; Tolerance: ±5%; Power (Watts): 5W; Composition: Wirewound; Package / Case: Axial; Operating Temperature: -55°C ~ 155°C; Size / Dimension: 0.380" Square x 0.866" L (9.65mm x 22.00mm)
R2 R3 = RES 1K OHM 0603: High Precision-High Stability Chip Resistor Thin Film 0603 1kOhm 0.1% Paper T/R; Manufacturer: Yageo; Desinged by: BERKE; Power Rating: 100mW; Voltage Rating: 75V; Temperature Coefficient: 25ppm/°C; Voltage Rating (DC): 50V; Supplier 1: Digi-Key; Manufacturer Part Number: RT0603BRD071KL; RoHS: Yes; Category: Chip SMD Resistors; Stock 1: 114977; Pricing 1: 1=0,34, 10=0,288, 100=0,1126, 500=0,06812, 1000=0,04716, 2500=0,04322 (USD); Mount: Surface Mount; Case/Package: 0603; Case Code (Metric): 1608; Case Code (Imperial): 0603; Contact Plating: Tin,Lead; Size Code: 0603; Min Operating Temperature: -55°C; Max Operating Temperature: 155°C; Package Quantity: 5000; Packaging: Tape and Reel; Termination: SMD/SMT; Series: RT; Technology: THIN FILM; Number of Terminations: 2; Max Power Dissipation: 100mW; Features: Moisture Resistant; Length: 0.063inch; Width: 0.031inch; Height: 0.022inch; Depth: 0.8mm; RoHS Compliant: Yes; Lead Free: Lead Free; ComponentLink1URL: https://datasheet.ciiva.com/5624/pyu-rt-1-to-0-05-rohs-l-4-5624759.pdf?src-supplier=Mouser; ComponentLink1Description: https://datasheet.ciiva.com/5624/pyu-rt-1-to-0-05-rohs-l-4-5624759.pdf?src-supplier=Mouser; ComponentLink2URL: https://datasheet.ciiva.com/29718/pyu-rt-1-to-0-05-rohs-l-4-29718010.pdf?src-supplier=Digi-Key; ComponentLink2Description: https://datasheet.ciiva.com/29718/pyu-rt-1-to-0-05-rohs-l-4-29718010.pdf?src-supplier=Digi-Key; Supplier Part Number 1: YAG1237CT-ND
R4 R5 = RES 10K OHM 0603: RES SMD 10K OHM 1% 1/10W 0603; Manufacturer: Yageo; Temperature Coefficient: 100ppm/°C; Voltage Rating (DC): 50V; Power Rating: 100mW; Voltage Rating: 75V; Desinged by: BERKE; Supplier 1: Digi-Key; Manufacturer Part Number: RC0603FR-0710KL; RoHS: Yes; Category: Chip SMD Resistors; Stock 1: 31631181; Pricing 1: 1=0,1, 10=0,019, 50=0,0114, 100=0,0094, 500=0,00628, 1000=0,00537 (USD); Case/Package: 0603; Number of Pins: 2; Case Code (Imperial): 0603; Case Code (Metric): 1608; Weight: 7.1E-05oz; Size Code: 0603; Min Operating Temperature: -55°C; Max Operating Temperature: 155°C; Tolerance: 1%; Resistor Type: Thick Film; Packaging: Tape and Reel; Termination: SMD/SMT; Features: Moisture Resistant; Series: RC; Max Power Dissipation: 100mW; Number of Terminations: 2; Resistance Tolerance: 1%; Construction: Rectangular; Length: 1.6mm; Width: 0.8mm; Height: 0.45mm; Depth: 0.8mm; Lead Pitch: 0.3mm; Reach SVHC Compliant: No; Lead Free: Lead Free; Military Standard: Not; RoHS Compliant: Yes; ComponentLink1URL: https://datasheet.ciiva.com/7660/38590-7660789.pdf?src-supplier=Element14; ComponentLink1Description: https://datasheet.ciiva.com/7660/38590-7660789.pdf?src-supplier=Element14; ComponentLink2URL: https://datasheet.ciiva.com/7983/443971-7983596.pdf?src-supplier=Element14; ComponentLink2Description: https://datasheet.ciiva.com/7983/443971-7983596.pdf?src-supplier=Element14; ComponentLink3URL: https://datasheet.ciiva.com/22747/443971-22747519.pdf?src-supplier=Element14; ComponentLink3Description: https://datasheet.ciiva.com/22747/443971-22747519.pdf?src-supplier=Element14; ComponentLink4URL: https://datasheet.ciiva.com/46440/1868787-46440891.pdf?src-supplier=Element14; ComponentLink4Description: https://datasheet.ciiva.com/46440/1868787-46440891.pdf?src-supplier=Element14; ComponentLink5URL: https://datasheet.ciiva.com/7746/1738695-7746239.pdf?src-supplier=Element14; ComponentLink5Description: https://datasheet.ciiva.com/7746/1738695-7746239.pdf?src-supplier=Element14; ComponentLink6URL: https://datasheet.ciiva.com/15189/getdatasheetpartid-409289-15189591.pdf?src-supplier=Verical; ComponentLink6Description: https://datasheet.ciiva.com/15189/getdatasheetpartid-409289-15189591.pdf?src-supplier=Verical; Supplier Part Number 1: 311-10.0KHRCT-ND
RL1 RL2 = ALQ112: General Purpose Relay SPDT (1 Form C) 12VDC Coil Through Hole; Manufacturer: Panasonic; Contact Current Rating: 10A; Voltage Rating (AC): 250V; Power Rating: 400mW; Coil Resistance: 360R; Coil Current: 33.3mA; Operate Time: 20ms; Coil Voltage (DC): 12V; Coil Type: Non-Latching; Desinged by: BERKE; Supplier 1: Digi-Key; Manufacturer Part Number: ALQ112; RoHS: Yes; Category: Power Relays; Stock 1: 87773; Pricing 1: 1=1,4, 10=1,312, 25=1,166, 50=1,1076, 100=1,0494, 250=0,9328, 500=0,8745, 1000=0,8162, 5000=0,78705 (USD); Number of Pins: 5; Contact Material: Silver; Weight: 7g; Min Operating Temperature: -40°C; Max Operating Temperature: 85°C; Package Quantity: 100; Packaging: Carton; Power Consumption: 400mW; Throw Configuration: SPDT; Termination: PC Pin; Release Time: 20ms; Max Voltage Rating (AC): 250V; Relay Type: General Purpose; Series: ALQ; Length: 20mm; Width: 10mm; Height: 16mm; Depth: 10mm; Lead Free: Lead Free; RoHS Compliant: Yes; Reach SVHC Compliant: Unknown; ComponentLink1URL: https://datasheet.ciiva.com/24388/307ds-61b20-en-lq-24388909.pdf?src-supplier=Onlinecomponents.com; ComponentLink1Description: https://datasheet.ciiva.com/24388/307ds-61b20-en-lq-24388909.pdf?src-supplier=Onlinecomponents.com; Supplier Part Number 1: 255-3562-ND; Case/Package: ALQ112
T1 = BV302S12010-ZU: 230-12V Transformer 1VA; Manufacturer: Zettler Magnetics; Desinged by: BERKE; Operating Frequency: 50-60Hz; Secondary Voltage: 12V; Primary Voltage: 230V; Supplier 1: Digi-Key; Supplier Part Number: 2469-BV302S12010-ZU-ND; RoHS: No; Manufacturer Part Number: BV302S12010-ZU
U1 = LM2675MX-12/NOPB: SIMPLE SWITCHER® 6.5V to 40V, 1A Low Component Count Step-Down Regulator 8-SOIC -40 to 125; Manufacturer: TI National Semiconductor; Desinged by: BERKE; Number of Outputs: 1; Output Voltage: 12V; Efficiency: 94%; Min Input Voltage: 8V; Switching Frequency: 260kHz; Quiescent Current: 2.5mA; Output Type: Fixed; Supplier 1: Digi-Key; Manufacturer Part Number: LM2675MX-12/NOPB; RoHS: Yes; Category: Voltage Regulators - Switching; Pricing 1: 1=4,8, 10=4,314, 25=4,0788, 100=3,535, 250=3,35368, 500=3,00924, 1000=2,53792 (USD); Mount: Surface Mount; Case/Package: SOIC N; Number of Pins: 8; Min Operating Temperature: -40°C; Max Operating Temperature: 125°C; Output Current: 1A; Packaging: Tape and Reel; Max Output Current: 1A; Max Input Voltage: 40V; Package Quantity: 2500; Operating Supply Voltage: 40V; Series: LM2675; Radiation Hardening: No; Lead Free: Lead Free; RoHS Compliant: Yes; ComponentLink1URL: https://datasheet.ciiva.com/41457/001013881-da-01-en-ic-reg-buck-lm2675mx-12-nopb-soic-8-tid-41457896.pdf?src-supplier=Conrad; ComponentLink1Description: https://datasheet.ciiva.com/41457/001013881-da-01-en-ic-reg-buck-lm2675mx-12-nopb-soic-8-tid-41457896.pdf?src-supplier=Conrad; ComponentLink2URL: https://datasheet.ciiva.com/3220/lm2675-3220840.pdf?src-supplier=Avnet; ComponentLink2Description: https://datasheet.ciiva.com/3220/lm2675-3220840.pdf?src-supplier=Avnet; Supplier Part Number 1: 296-35410-6-ND
U2 = AP7361-33E-13: AP7361 Series 3.3 V 1 A Low SMT Dropout Fixed-Mode Regulator - SOT-223; Manufacturer: Diodes; Desinged by: BERKE; Number of Outputs: 1; Min Input Voltage: 2.2V; Max Input Voltage: 6V; Max Output Current: 1A; Output Voltage: 3.3V; Max Power Dissipation: 1.1W; Dropout Voltage: 500mV; Min Current Limit: 1.1A; Polarity: Positive; Quiescent Current: 70uA; Power Dissipation: 1.1kW; Accuracy: 1%; Power Supply Rejection Ratio (PSRR): 65dB; Reference Voltage: 800mV; Output Type: Fixed; Supplier 1: Digi-Key; Manufacturer Part Number: AP7361-33E-13; RoHS: Yes; Category: Voltage Regulators - Linear; Pricing 1: 1=0,51, 10=0,41, 25=0,3748, 100=0,279, 250=0,25288, 500=0,20928, 1000=0,15696 (USD); Mount: Surface Mount; Case/Package: SOT-223; Number of Pins: 4; Weight: 0.000282oz; Contact Plating: Tin,Matte; Min Operating Temperature: -40°C; Max Operating Temperature: 85°C; Package Quantity: 1; Packaging: Tape and Reel; Output Current: 1A; Number of Regulators: 1; Series: -; Radiation Hardening: No; Reach SVHC Compliant: Yes; Lead Free: Lead Free; RoHS Compliant: Yes; ComponentLink1URL: https://datasheet.ciiva.com/26926/getdatasheetpartid-670786-26926141.pdf?src-supplier=Verical; ComponentLink1Description: https://datasheet.ciiva.com/26926/getdatasheetpartid-670786-26926141.pdf?src-supplier=Verical; ComponentLink2URL: https://datasheet.ciiva.com/25651/ap7361-25651049.pdf?src-supplier=Digi-Key; ComponentLink2Description: https://datasheet.ciiva.com/25651/ap7361-25651049.pdf?src-supplier=Digi-Key; ComponentLink3URL: https://datasheet.ciiva.com/29568/ap7361-29568378.pdf?src-supplier=Digi-Key; ComponentLink3Description: https://datasheet.ciiva.com/29568/ap7361-29568378.pdf?src-supplier=Digi-Key; ComponentLink4URL: https://datasheet.ciiva.com/29568/ap7361-29568379.pdf?src-supplier=Digi-Key; ComponentLink4Description: https://datasheet.ciiva.com/29568/ap7361-29568379.pdf?src-supplier=Digi-Key; Supplier Part Number 1: AP7361-33E-13DICT-ND
USB1 = Micro B USB Connector: CONN USB MICRO B RECPT SMT R/A; Manufacturer: Amphenol ICC / FCI; Connector Type: USB,Receptacle; USB Standard: USB 2.0; Number of Contacts: 5; Gender: Receptacle; Current Rating: 1.8A; Insulation Resistance: 1GR; Number of Ports: 1; Max Voltage Rating (AC): 100V; Pitch: 0.65mm; Desinged by: BERKE; Supplier 1: Digi-Key; Manufacturer Part Number: 10118192-0001LF; RoHS: No; Category: USB Connectors; Stock 1: 121994; Pricing 1: 1=0,46, 10=0,404, 25=0,3696, 50=0,3478, 100=0,3334, 250=0,30436, 500=0,28988 (USD); Mount: Surface Mount,Horizontal; Number of Pins: 5; Color: Black; Contact Material: Copper Alloy; Contact Plating: Gold; Housing Material: Polymer; Min Operating Temperature: -55°C; Max Operating Temperature: 85°C; Termination: Solder; Orientation: Right Angle; Features: Shielded; Series: -; Packaging: Tape and Reel; Package Quantity: 1400; Voltage Rating: 100V; Length: 7.86mm; Depth: 5.57mm; Radiation Hardening: No; Flammability Rating: UL94 V-0; Reach SVHC Compliant: No; ComponentLink1URL: http://uk.rs-online.com/webdocs/1450/0900766b814507ee.pdf?src-supplier=Rs; ComponentLink1Description: http://uk.rs-online.com/webdocs/1450/0900766b814507ee.pdf?src-supplier=Rs; ComponentLink2URL: http://www.amphenol-icc.com/media/wysiwyg/files/drawing/10118192.pdf?src-supplier=Digi-Key; ComponentLink2Description: http://www.amphenol-icc.com/media/wysiwyg/files/drawing/10118192.pdf?src-supplier=Digi-Key; ComponentLink3URL: http://www.farnell.com/datasheets/2366786.pdf?src-supplier=Farnell; ComponentLink3Description: http://www.farnell.com/datasheets/2366786.pdf?src-supplier=Farnell; ComponentLink4URL: https://cdn.amphenol-icc.com/media/wysiwyg/files/documentation/datasheet/inputoutput/io_usb_micro.pdf?src-supplier=Verical; ComponentLink4Description: https://cdn.amphenol-icc.com/media/wysiwyg/files/documentation/datasheet/inputoutput/io_usb_micro.pdf?src-supplier=Verical; ComponentLink5URL: https://cdn.amphenol-icc.com/media/wysiwyg/files/documentation/datasheet/inputoutput/io_usb_micro.pdf?src-supplier=Arrow+Electronics; ComponentLink5Description: https://cdn.amphenol-icc.com/media/wysiwyg/files/documentation/datasheet/inputoutput/io_usb_micro.pdf?src-supplier=Arrow+Electronics; ComponentLink6URL: https://cdn.amphenol-icc.com/media/wysiwyg/files/documentation/datasheet/inputoutput/io_usb_micro.pdf?src-supplier=Avnet; ComponentLink6Description: https://cdn.amphenol-icc.com/media/wysiwyg/files/documentation/datasheet/inputoutput/io_usb_micro.pdf?src-supplier=Avnet; ComponentLink7URL: http://www.farnell.com/cad/1935767.pdf?src-supplier=Element14; ComponentLink7Description: http://www.farnell.com/cad/1935767.pdf?src-supplier=Element14; ComponentLink8URL: https://cdn.amphenol-icc.com/media/wysiwyg/files/documentation/datasheet/inputoutput/io_usb_micro.pdf?src-supplier=Allied+Electronics; ComponentLink8Description: https://cdn.amphenol-icc.com/media/wysiwyg/files/documentation/datasheet/inputoutput/io_usb_micro.pdf?src-supplier=Allied+Electronics; ComponentLink9URL: http://www.farnell.com/datasheets/2366786.pdf?src-supplier=Newark; ComponentLink9Description: http://www.farnell.com/datasheets/2366786.pdf?src-supplier=Newark; ComponentLink10URL: https://cdn.amphenol-icc.com/media/wysiwyg/files/documentation/datasheet/inputoutput/io_usb_micro.pdf?src-supplier=Mouser; ComponentLink10Description: https://cdn.amphenol-icc.com/media/wysiwyg/files/documentation/datasheet/inputoutput/io_usb_micro.pdf?src-supplier=Mouser; ComponentLink11URL: https://cdn.amphenol-icc.com/media/wysiwyg/files/documentation/datasheet/inputoutput/io_usb_micro.pdf?src-supplier=Freelance+Electronics; ComponentLink11Description: https://cdn.amphenol-icc.com/media/wysiwyg/files/documentation/datasheet/inputoutput/io_usb_micro.pdf?src-supplier=Freelance+Electronics; ComponentLink12URL: https://cdn.amphenol-icc.com/media/wysiwyg/files/documentation/datasheet/inputoutput/io_usb_micro.pdf?src-supplier=Heilind+Electronics; ComponentLink12Description: https://cdn.amphenol-icc.com/media/wysiwyg/files/documentation/datasheet/inputoutput/io_usb_micro.pdf?src-supplier=Heilind+Electronics; ComponentLink13URL: https://cdn.amphenol-icc.com/media/wysiwyg/files/documentation/datasheet/inputoutput/io_usb_micro.pdf?src-supplier=TME; ComponentLink13Description: https://cdn.amphenol-icc.com/media/wysiwyg/files/documentation/datasheet/inputoutput/io_usb_micro.pdf?src-supplier=TME; ComponentLink14URL: https://cdn.amphenol-icc.com/media/wysiwyg/files/documentation/datasheet/inputoutput/io_usb_micro.pdf?src-supplier=TTI; ComponentLink14Description: https://cdn.amphenol-icc.com/media/wysiwyg/files/documentation/datasheet/inputoutput/io_usb_micro.pdf?src-supplier=TTI; ComponentLink15URL: https://cdn.amphenol-icc.com/media/wysiwyg/files/documentation/datasheet/inputoutput/io_usb_micro.pdf?src-supplier=NAC+Semi; ComponentLink15Description: https://cdn.amphenol-icc.com/media/wysiwyg/files/documentation/datasheet/inputoutput/io_usb_micro.pdf?src-supplier=NAC+Semi; ComponentLink16URL: https://cdn.amphenol-icc.com/media/wysiwyg/files/documentation/datasheet/inputoutput/io_usb_micro.pdf?src-supplier=SOS+electronic; ComponentLink16Description: https://cdn.amphenol-icc.com/media/wysiwyg/files/documentation/datasheet/inputoutput/io_usb_micro.pdf?src-supplier=SOS+electronic; Supplier Part Number 1: 609-4613-1-ND